# EAGLE design untitled (EAGLE 9.6.2)
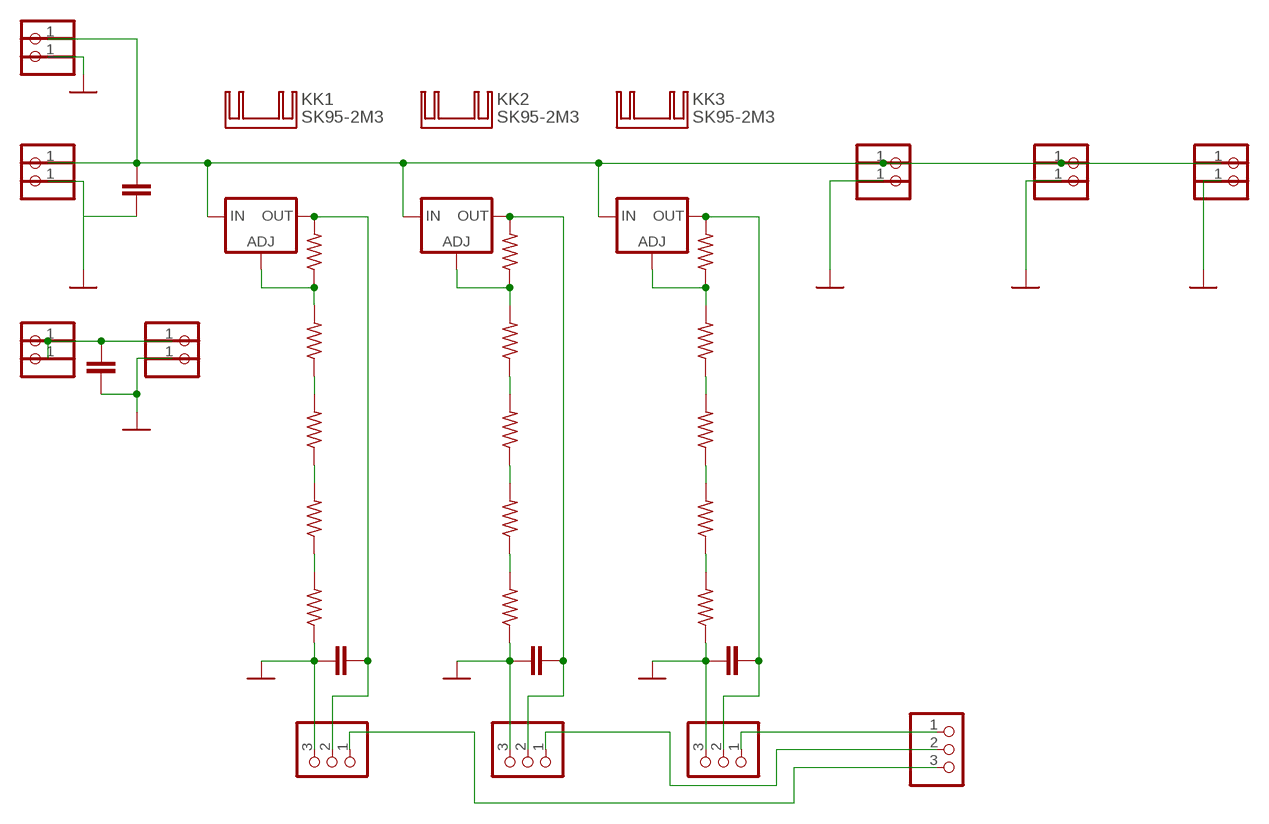
[diagram p0: schematic, sheet 1]

## Parts
5V  PINHD-1X1  [1X01]
5V+  PINHD-1X1  [1X01]
5V-  PINHD-1X1  [1X01]
5VV  PINHD-1X1  [1X01]
BATTERY+  PINHD-1X1  [1X01]
BATTERY-  PINHD-1X1  [1X01]
C1  C-EU025-050X050  [C025-050X050]
C2  C-EU025-050X050  [C025-050X050]
C3  C-EU025-050X050  [C025-050X050]
C4  C-EU025-050X050  [C025-050X050]
C5  C-EU025-050X050  [C025-050X050]
D1+  PINHD-1X1  [1X01]
D1-  PINHD-1X1  [1X01]
D2+  PINHD-1X1  [1X01]
D2-  PINHD-1X1  [1X01]
D3+  PINHD-1X1  [1X01]
D3-  PINHD-1X1  [1X01]
IC4  LM317TS  [317TS]
IC5  LM317TS  [317TS]
IC6  LM317TS  [317TS]
JP1  PINHD-1X3  [1X03]
JP2  PINHD-1X3  [1X03]
JP3  PINHD-1X3  [1X03]
JP6  PINHD-1X3  [1X03]
KK1  SK95-2M3  [SK95-2M3]
KK2  SK95-2M3  [SK95-2M3]
KK3  SK95-2M3  [SK95-2M3]
R1  R-US_0207/10  [0207/10]
R2  R-US_0207/10  [0207/10]
R5  R-US_0207/10  [0207/10]
R6  R-US_0207/10  [0207/10]
R7  R-US_0207/10  [0207/10]
R8  R-US_0207/10  [0207/10]
R9  R-US_0207/10  [0207/10]
R10  R-US_0207/10  [0207/10]
R11  R-US_0207/10  [0207/10]
R12  R-US_0207/10  [0207/10]
R13  R-US_0207/10  [0207/10]
R14  R-US_0207/10  [0207/10]
R15  R-US_0207/10  [0207/10]
R16  R-US_0207/10  [0207/10]
R17  R-US_0207/10  [0207/10]
SOLAR+  PINHD-1X1  [1X01]
SOLAR-  PINHD-1X1  [1X01]

## Nets
GND: 5V-.1 BATTERY-.1 C1.1 C2.1 C3.1 C4.2 C5.2 D1-.1 D2-.1 D3-.1 JP1.3 JP2.3 JP3.3 R8.1 R13.1 R17.1 SOLAR-.1
N$1: C1.2 IC4.2(OUT) JP2.2 R10.2
N$2: IC4.1(ADJ) R9.2 R10.1
N$3: R9.1 R11.2
N$4: R11.1 R12.2
N$5: R12.1 R13.2
N$8: R1.1 R6.2
N$9: R6.1 R7.2
N$10: R7.1 R8.2
N$11: C3.2 IC5.2(OUT) JP3.2 R5.2
N$12: IC5.1(ADJ) R5.1 R14.2
N$13: R14.1 R15.2
N$14: R15.1 R16.2
N$15: R16.1 R17.2
N$16: BATTERY+.1 C4.1 D1+.1 D2+.1 D3+.1 IC4.3(IN) IC5.3(IN) IC6.3(IN) SOLAR+.1
N$17: JP2.1 JP6.3
N$18: JP1.1 JP6.2
N$19: JP3.1 JP6.1
N$20: 5V+.1 5V.1 5VV.1 C5.1
N$21: C2.2 IC6.2(OUT) JP1.2 R2.2
N$22: IC6.1(ADJ) R1.2 R2.1

## Library data of the parts
5V 5V+ 5V- 5VV BATTERY+ BATTERY- D1+ D1- D2+ D2- D3+ D3- SOLAR+ SOLAR- = pinhead:PINHD-1X1: PIN HEADER
C1-C5 = rcl:C-EU: CAPACITOR, European symbol; SPICEPREFIX: C
IC4-IC6 = v-reg:LM317TS: VOLTAGE REGULATOR
JP1-JP3 JP6 = pinhead:PINHD-1X3: PIN HEADER
KK1-KK3 = heatsink:SK95-2M3: HEATSINK manufacturer Fischer/distributor Buerklin
R1 R2 R5-R17 = rcl:R-US_: RESISTOR, American symbol; SPICEPREFIX: R

## Net classes
0 default: clearance 0.205 mm

## Board
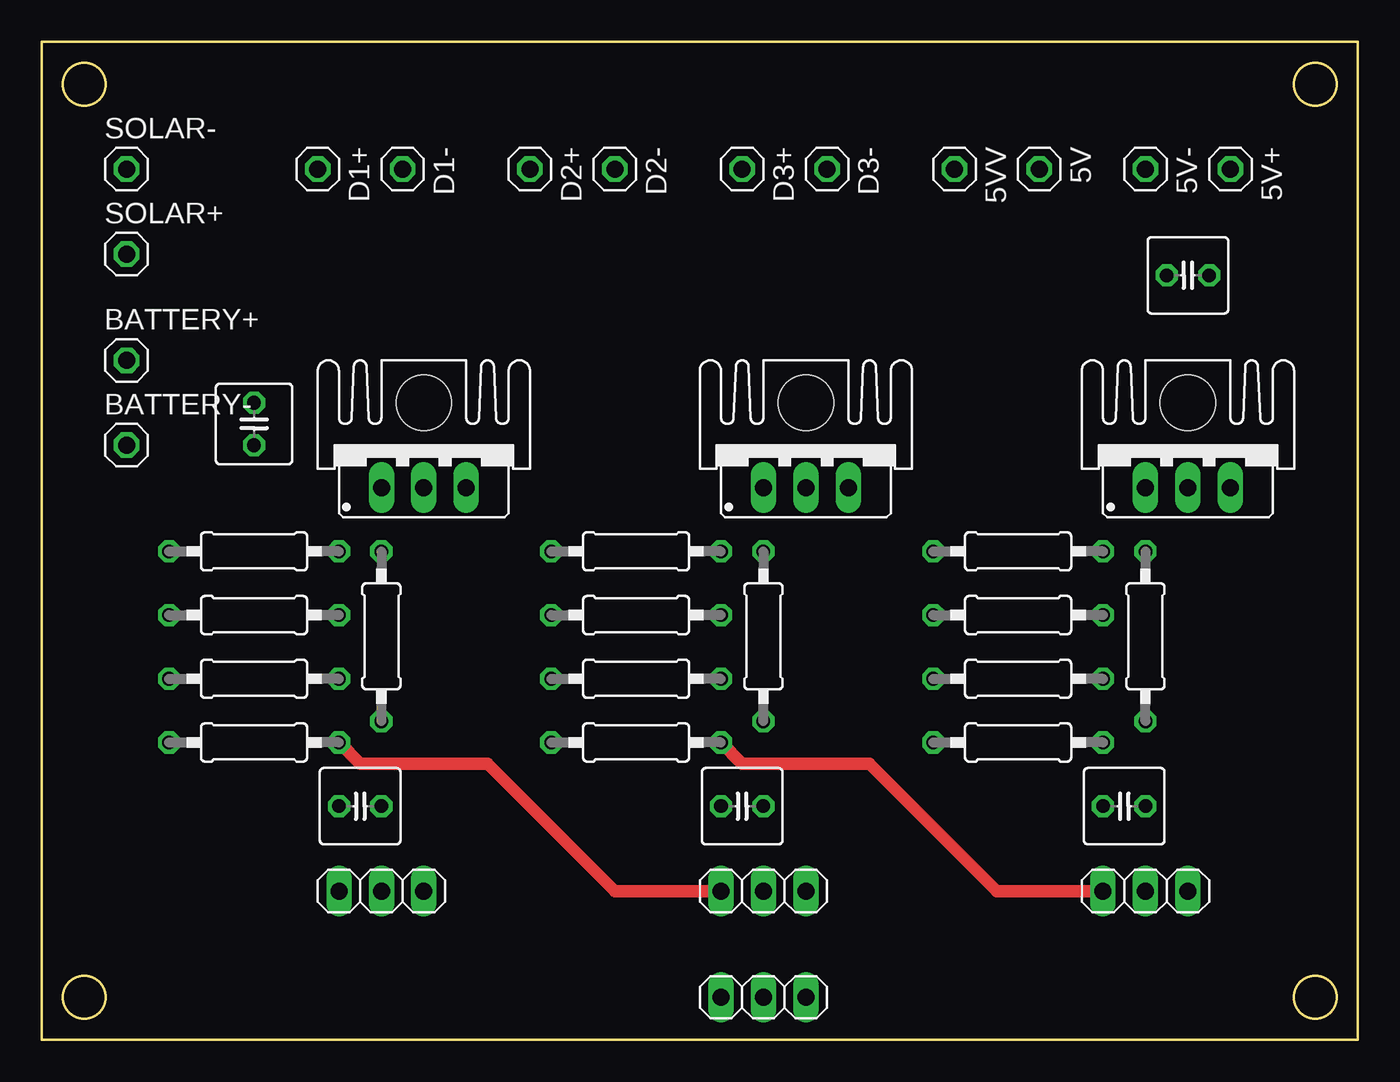
[diagram p1: board, top side]
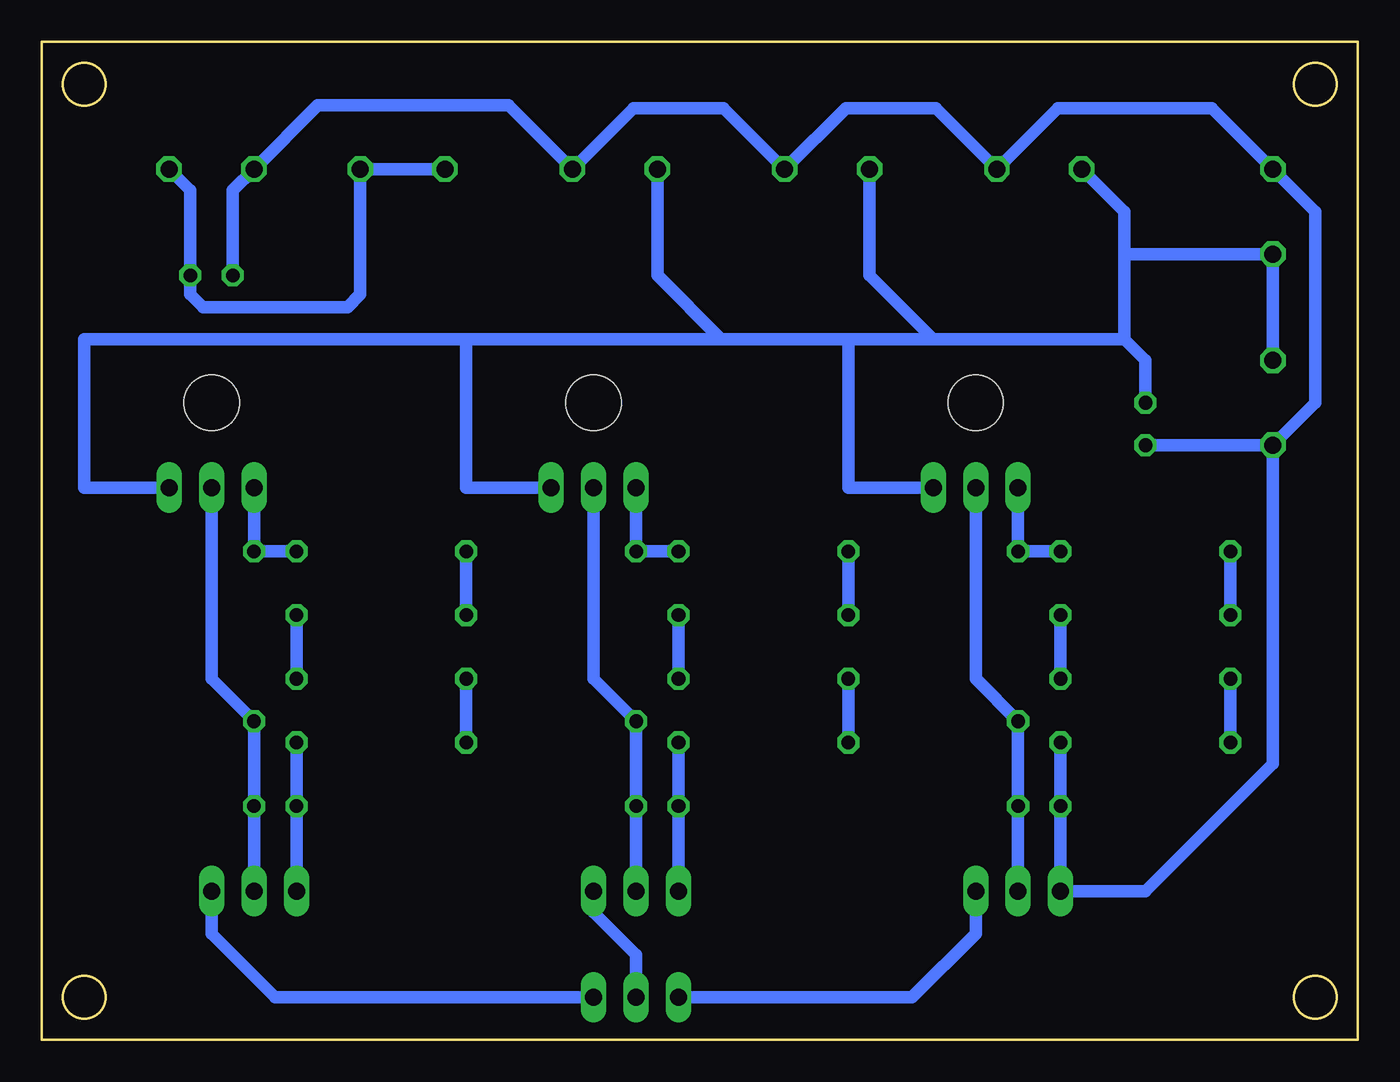
[diagram p2: board, bottom side, seen from below]

Size 78.74 x 59.69 mm. Coordinates in mm from the lower left corner, seen from the top.
Outline: 0,0 0,59.69 78.74,59.69 78.74,0 0,0
Outline: circle at 2.54,57.15 radius 1.27
Outline: circle at 76.2,57.15 radius 1.27
Outline: circle at 76.2,2.54 radius 1.27
Outline: circle at 2.54,2.54 radius 1.27
Copper layers (1*16): Top 0.035mm / dielectric 1.5mm / Bottom 0.035mm
Design rules "default *": minimum track width 15mil, minimum drill 0.35mm, track to track 15mil, track to pad 6mil, pad to pad 6mil, via to via 6mil, smd to smd 6mil, copper to edge 15mil, drill to drill 6mil, minimum pad ring 10mil, minimum via ring 8mil, stop-mask expansion 4mil, vias tented up to drill 0mil, thermal gap 10mil

### Footprints (pad centres in the part's own frame; a part is rotated, then mirrored left to right if it is on the bottom)
1X01 = drill 1.016 octagon: 1 0,0
C025-050X050 = drill 0.813 octagon: 1 -1.27,0; 2 1.27,0
317TS = drill 1.016 long: 1 -2.54,-2.54; 2 0,-2.54; 3 2.54,-2.54
1X03 = drill 1.016 long: 1 -2.54,0; 2 0,0; 3 2.54,0
SK95-2M3 = hole 3.302: 0,2.54
0207/10 = drill 0.813 octagon: 1 -5.08,0; 2 5.08,0

### Placement (x,y rotation side)
5V  59.69,52.07 270 top
5V+  71.12,52.07 270 top
5V-  66.04,52.07 270 top
5VV  54.61,52.07 270 top
BATTERY+  5.08,40.64 0 top
BATTERY-  5.08,35.56 0 top
C1  64.77,13.97 0 top
C2  41.91,13.97 0 top
C3  19.05,13.97 0 top
C4  12.7,36.83 270 top
C5  68.58,45.72 180 top
D1+  16.51,52.07 270 top
D1-  21.59,52.07 270 top
D2+  29.21,52.07 270 top
D2-  34.29,52.07 270 top
D3+  41.91,52.07 270 top
D3-  46.99,52.07 270 top
IC4  68.58,35.56 0 top
IC5  22.86,35.56 0 top
IC6  45.72,35.56 0 top
JP1  43.18,8.89 180 top
JP2  66.04,8.89 180 top
JP3  20.32,8.89 180 top
JP6  43.18,2.54 0 top
KK1  45.72,35.56 0 top
KK2  22.86,35.56 0 top
KK3  68.58,35.56 0 top
R1  35.56,29.21 0 top
R2  43.18,24.13 270 top
R5  20.32,24.13 270 top
R6  35.56,25.4 180 top
R7  35.56,21.59 0 top
R8  35.56,17.78 180 top
R9  58.42,29.21 0 top
R10  66.04,24.13 270 top
R11  58.42,25.4 180 top
R12  58.42,21.59 0 top
R13  58.42,17.78 180 top
R14  12.7,29.21 0 top
R15  12.7,25.4 180 top
R16  12.7,21.59 0 top
R17  12.7,17.78 180 top
SOLAR+  5.08,46.99 0 top
SOLAR-  5.08,52.07 0 top

### Tracks (layer width: path | path; a pad name or v marks a point on that pad's centre or on a via)
GND
  Top 0.762: R17.1 19.05,16.51 26.67,16.51 34.29,8.89 JP1.3 | R8.1 41.91,16.51 49.53,16.51 57.15,8.89 JP2.3
  Bottom 0.762: BATTERY-.1 C4.2 | BATTERY-.1 5.08,16.51 12.7,8.89 JP3.3 | BATTERY-.1 2.54,38.1 2.54,49.53 SOLAR-.1 8.74,55.73 17.93,55.73 D1-.1 25.25,55.73 30.63,55.73 D2-.1 37.95,55.73 43.33,55.73 D3-.1 50.8,55.88 62.23,55.88 5V-.1 67.31,50.8 C5.2 | R17.1 JP3.3 | JP3.3 C3.1 | C2.1 JP1.3 R8.1 | C1.1 JP2.3 R13.1
N$1
  Bottom 0.762: C1.2 JP2.2 R10.2 68.58,21.59 IC4.2
N$2
  Bottom 0.762: R9.2 R10.1 IC4.1
N$3
  Bottom 0.762: R9.1 R11.2
N$4
  Bottom 0.762: R11.1 R12.2
N$5
  Bottom 0.762: R12.1 R13.2
N$8
  Bottom 0.762: R6.2 R1.1
N$9
  Bottom 0.762: R7.2 R6.1
N$10
  Bottom 0.762: R7.1 R8.2
N$11
  Bottom 0.762: C3.2 JP3.2 R5.2 22.86,21.59 IC5.2
N$12
  Bottom 0.762: R14.2 R5.1 IC5.1
N$13
  Bottom 0.762: R14.1 R15.2
N$14
  Bottom 0.762: R15.1 R16.2
N$15
  Bottom 0.762: R16.1 R17.2
N$16
  Bottom 0.762: C4.1 12.7,40.64 13.97,41.91 | D1+.1 13.97,49.53 13.97,46.99 | 13.97,46.99 13.97,41.91 | 13.97,41.91 25.4,41.91 | 25.4,41.91 30.48,41.91 | 53.34,41.91 38.1,41.91 | 38.1,41.91 30.48,41.91 | 53.34,41.91 53.34,33.02 IC6.3 | 53.34,41.91 76.2,41.91 76.2,33.02 IC4.3 | 30.48,41.91 30.48,33.02 IC5.3 | 25.4,41.91 29.21,45.72 D2+.1 | D3+.1 41.91,45.72 38.1,41.91 | BATTERY+.1 SOLAR+.1 13.97,46.99
N$17
  Bottom 0.762: JP6.3 64.77,2.54 68.58,6.35 JP2.1
N$18
  Bottom 0.762: JP6.2 43.18,5.08 45.72,7.62 JP1.1
N$19
  Bottom 0.762: JP3.1 22.86,6.35 26.67,2.54 JP6.1
N$20
  Bottom 0.762: 5VV.1 5V.1 59.69,44.58 60.45,43.81 69.09,43.81 69.85,44.58 C5.1 69.85,50.8 5V+.1
N$21
  Bottom 0.762: C2.2 JP1.2 R2.2 45.72,21.59 IC6.2
N$22
  Bottom 0.762: R1.2 R2.1 IC6.1